# Altium project SuperBALL_Mater_Schematics.PrjPcb
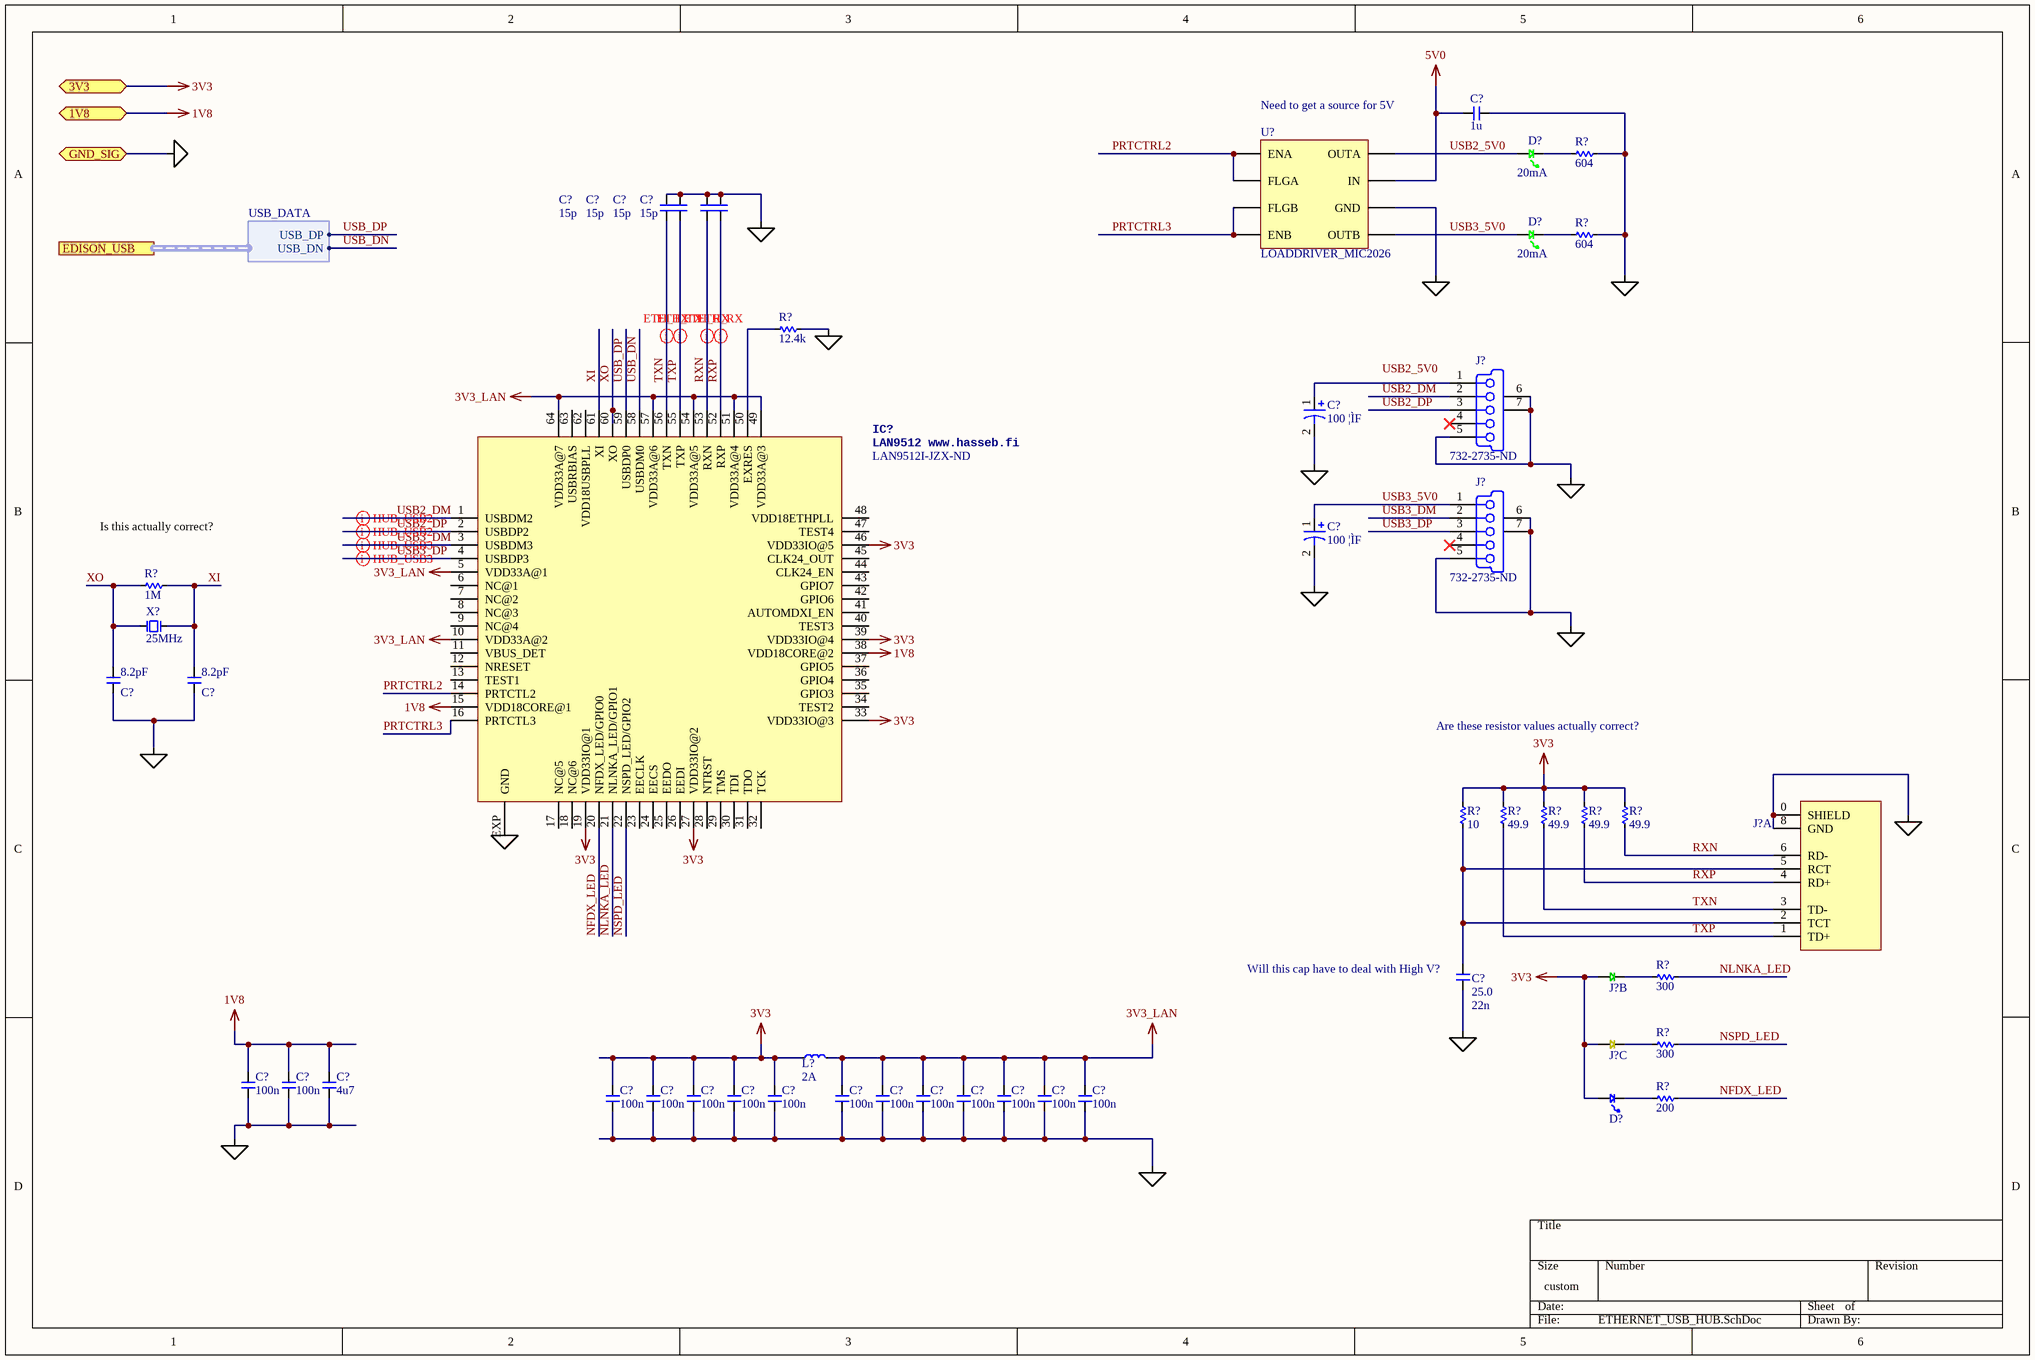
[diagram p0: ETHERNET_USB_HUB.SchDoc]
3 sheets, 59 parts. Net scope: strictly hierarchical (ports join the sheet entries above them; power ports are local).
Board file: Fake.PcbDoc
Sheets:
  ETHERNET_USB_HUB.SchDoc
  PIC.SchDoc
  RF.SchDoc

## Sheet ETHERNET_USB_HUB.SchDoc
size 381 x 254 mm

### Parts
(Parts that share a designator on the sheet are numbered #1, #2 ... from top to bottom, then left to right.)
C?#1  human_value: 1u  [C0603]  (hidden comment: __template_cap)
C?#2  human_value: 15p  [C0603]  (hidden comment: __template_cap)
C?#3  human_value: 15p  [C0603]  (hidden comment: __template_cap)
C?#4  human_value: 15p  [C0603]  (hidden comment: __template_cap)
C?#5  human_value: 15p  [C0603]  (hidden comment: __template_cap)
C?#6  100 ¦ÌF  [WCAP-ASLI 6.3x5.5x2.2]
C?#7  100 ¦ÌF  [WCAP-ASLI 6.3x5.5x2.2]
C?#8  Capacitance: 8.2pF  [c0603]  (hidden comment: __template_cap)
C?#9  Capacitance: 8.2pF  [c0603]  (hidden comment: __template_cap)
C?#10  voltage: 25.0  human_value: 22n  [C0603]  (hidden comment: __template_cap)
C?#11  human_value: 100n  [C0603]  (hidden comment: __template_cap)
C?#12  human_value: 100n  [C0603]  (hidden comment: __template_cap)
C?#13  human_value: 4u7  [C0603]  (hidden comment: __template_cap)
C?#14  human_value: 100n  [C0603]  (hidden comment: __template_cap)
C?#15  human_value: 100n  [C0603]  (hidden comment: __template_cap)
C?#16  human_value: 100n  [C0603]  (hidden comment: __template_cap)
C?#17  human_value: 100n  [C0603]  (hidden comment: __template_cap)
C?#18  human_value: 100n  [C0603]  (hidden comment: __template_cap)
C?#19  human_value: 100n  [C0603]  (hidden comment: __template_cap)
C?#20  human_value: 100n  [C0603]  (hidden comment: __template_cap)
C?#21  human_value: 100n  [C0603]  (hidden comment: __template_cap)
C?#22  human_value: 100n  [C0603]  (hidden comment: __template_cap)
C?#23  human_value: 100n  [C0603]  (hidden comment: __template_cap)
C?#24  human_value: 100n  [C0603]  (hidden comment: __template_cap)
C?#25  human_value: 100n  [C0603]  (hidden comment: __template_cap)
D?#1  Current - Test: 20mA  [0805_Diode]  (hidden comment: LED_LY971)
D?#2  Current - Test: 20mA  [0805_Diode]  (hidden comment: LED_LY971)
D?#3  LED_LBQ39G_BLUE  [LED_0603P_BLUE]  (value not drawn)
IC?  LAN9512 www.hasseb.fi  Supplier Part Number 1: LAN9512I-JZX-ND  [QFN64-9X9]
J?#1  732-2735-ND  [CONN_USBMINIB_VERTICAL_WE]
J?#2  732-2735-ND  [CONN_USBMINIB_VERTICAL_WE]
J?#3  CONN_ETHERNET_MAG_PARJC07-111071A  [ETHERNET_MAG_ARJC07-111071A]  (value not drawn)  (part A of 3)
J?#4  CONN_ETHERNET_MAG_PARJC07-111071A  [ETHERNET_MAG_ARJC07-111071A]  (value not drawn)  (part B of 3)
J?#5  CONN_ETHERNET_MAG_PARJC07-111071A  [ETHERNET_MAG_ARJC07-111071A]  (value not drawn)  (part C of 3)
L?  Current Rating (Max): 2A  [R0603]
R?#1  value 604  [R0603]  (hidden comment: __template_resistor)
R?#2  value 604  [R0603]  (hidden comment: __template_resistor)
R?#3  value 12.4k  [R0603]  (hidden comment: __template_resistor)
R?#4  value 1M  [R0603]  (hidden comment: __template_resistor)
R?#5  value 10  [R0603]  (hidden comment: __template_resistor)
R?#6  value 49.9  [R0603]  (hidden comment: __template_resistor)
R?#7  value 49.9  [R0603]  (hidden comment: __template_resistor)
R?#8  value 49.9  [R0603]  (hidden comment: __template_resistor)
R?#9  value 49.9  [R0603]  (hidden comment: __template_resistor)
R?#10  value 300  [R0603]  (hidden comment: __template_resistor)
R?#11  value 300  [R0603]  (hidden comment: __template_resistor)
R?#12  value 200  [R0603]  (hidden comment: __template_resistor)
U?#1  LOADDRIVER_MIC2026  [8SOIC150]
X?  Frequency: 25MHz  [4_SMD_3.2X2.5MM]  (hidden comment: XTAL_ XC1817CT-ND)

### Ports
1V8, 3V3, EDISON_USB (harness USB_DATA), GND_SIG

### Harnesses
USB_DATA: USB_DP, USB_DN

### Nets
1V8: C?#11.1 C?#12.1 C?#13.1 IC?.15(VDD18CORE@1) IC?.38(VDD18CORE@2) ; port 1V8
3V3: C?#14.1 C?#15.1 C?#16.1 C?#17.1 C?#18.1 D?#3.2 IC?.19(VDD33IO@1) IC?.27(VDD33IO@2) IC?.33(VDD33IO@3) IC?.39(VDD33IO@4) IC?.46(VDD33IO@5) J?#4.11 J?#5.9 L?.1 R?#5.2 R?#6.2 R?#7.2 R?#8.2 R?#9.2 ; port 3V3
3V3_LAN: C?#19.1 C?#20.1 C?#21.1 C?#22.1 C?#23.1 C?#24.1 C?#25.1 IC?.5(VDD33A@1) IC?.10(VDD33A@2) IC?.49(VDD33A@3) IC?.51(VDD33A@4) IC?.54(VDD33A@5) IC?.57(VDD33A@6) IC?.64(VDD33A@7) L?.2
5V0: C?#1.2 U?#1.7(IN)
GDNSIG: C?#1.1 C?#2.1 C?#3.1 C?#4.1 C?#5.1 C?#6.2 C?#7.2 C?#8.2 C?#9.2 C?#10.2 C?#11.2 C?#12.2 C?#13.2 C?#14.2 C?#15.2 C?#16.2 C?#17.2 C?#18.2 C?#19.2 C?#20.2 C?#21.2 C?#22.2 C?#23.2 C?#24.2 C?#25.2 IC?.EXP(GND) J?#1.5(GND) J?#1.6(MH1) J?#1.7(MH2) J?#2.5(GND) J?#2.6(MH1) J?#2.7(MH2) J?#3.0(SHIELD) J?#3.8(GND) R?#1.2 R?#2.2 R?#3.2 U?#1.6(GND) ; port GND_SIG
NFDX_LED: IC?.20(NFDX_LED/GPIO0) R?#12.2
NLNKA_LED: IC?.21(NLNKA_LED/GPIO1) R?#10.2
NSPD_LED: IC?.22(NSPD_LED/GPIO2) R?#11.2
PRTCTRL2: IC?.14(PRTCTL2) U?#1.1(ENA) U?#1.2(FLGA)
PRTCTRL3: IC?.16(PRTCTL3) U?#1.3(FLGB) U?#1.4(ENB)
RXN: C?#4.2 IC?.53(RXN) J?#3.6(RD-) R?#9.1
RXP: C?#5.2 IC?.52(RXP) J?#3.4(RD+) R?#8.1
TXN: C?#2.2 IC?.56(TXN) J?#3.3(TD-) R?#7.1
TXP: C?#3.2 IC?.55(TXP) J?#3.1(TD+) R?#6.1
USB2_5V0: D?#1.2 U?#1.8(OUTA)
USB2_DM: IC?.1(USBDM2) J?#1.2(D-)
USB2_DP: IC?.2(USBDP2) J?#1.3(D+)
USB3_5V0: C?#7.1 D?#2.2 J?#2.1(V_BUS) U?#1.5(OUTB)
USB3_DM: IC?.3(USBDM3) J?#2.2(D-)
USB3_DP: IC?.4(USBDP3) J?#2.3(D+)
USB_DN: IC?.58(USBDM0) ; port EDISON_USB.USB_DN
USB_DP: IC?.59(USBDP0) ; port EDISON_USB.USB_DP
XI: C?#9.1 IC?.61(XI) R?#4.2 X?.2
XO: C?#8.1 IC?.60(XO) R?#4.1 X?.1
NetC?#6_1: C?#6.1 J?#1.1(V_BUS)
NetC?#10_1: C?#10.1 J?#3.2(TCT) J?#3.5(RCT) R?#5.1
NetD?#1_1: D?#1.1 R?#1.1
NetD?#2_1: D?#2.1 R?#2.1
NetD?#3_1: D?#3.1 R?#12.1
NetIC?_50: IC?.50(EXRES) R?#3.1
NetJ?#4_12: J?#4.12 R?#10.1
NetJ?#5_10: J?#5.10 R?#11.1

Not connected (* = marked no-connect by the designer): IC? 6(NC@1) 7(NC@2) 8(NC@3) 9(NC@4) 11(VBUS_DET) 12(NRESET) 13(TEST1) 17(NC@5) 18(NC@6) 23(EECLK) 24(EECS) 25(EEDO) 26(EEDI) 28(NTRST) 29(TMS) 30(TDI) 31(TDO) 32(TCK) 34(TEST2) 35(GPIO3) 36(GPIO4) 37(GPIO5) 40(TEST3) 41(AUTOMDXI_EN) 42(GPIO6) 43(GPIO7) 44(CLK24_EN) 45(CLK24_OUT) 47(TEST4) 48(VDD18ETHPLL) 62(VDD18USBPLL) 63(USBRBIAS); J?#1 4(ID)*; J?#2 4(ID)*

### Layout directives
differential pair: RXN, RXP, TXN, TXP, USB2_DM, USB2_DP, USB3_DM, USB3_DP

### Notes on the sheet
- Need to get a source for 5V
- (near R?#4) Is this actually correct?
- Are these resistor values actually correct?
- (near C?#10) Will this cap have to deal with High V?
- Labels drawn without touching a wire or pin: USB2_5V0

### Library data of the parts
C?#1 = 587-1251-1-ND: voltage: 16.0; type: capacitor; value: 1e-06; tolerance: 10%; Supplier Part Number 1: 587-1251-1-ND; package: 0603; price: 0.125
C?#2-C?#5 = 478-1165-1-ND: voltage: 50.0; type: capacitor; value: 1.5e-11; tolerance: 5%; Supplier Part Number 1: 478-1165-1-ND; package: 0603; price: 0.16
C?#6 C?#7 = WCAP-ASLI 6.3x5.5x2.2 865080243007: WCAP-ASLI Aluminum Electrolytic Capacitors , 100 ¦ÌF; + / - 20%; 10 V , 6,3 x 5,5; Manufacturer: Wurth Elektronik; E-mail: libraries@we-online.com; Characteristics: Aluminum Electrolytic Capacitor;Recommended soldering: Reflow;Operating temperature: ¨C55 ¡ãC to +105 ¡ãC;Low impedance product series;Load life: 2000 h @ +105 ¡ãC; ComponentLink1Description: Manufacturer; ComponentLink1URL: http://www.we-online.com; ComponentLink2Description: Datasheet; ComponentLink2URL: http://katalog.we-online.de/pbs/datasheet/865080243007.pdf; Created by: Karrer Zheng; Created Date: 5/13/2015; Capacitance: 100 ¦ÌF; Application: Energy storage or high frequency filtering in the low voltage circuit; used as power supply filtering in general switching power supply, DC-DC converter, AC-DC converter, conversion adapter, charger, TV, VCR, DC motor circuit filter, digital audio, digital TV, digital camera, digital video camera, satellite receiver, equipment control panel and etc.; partNo: 865080243007
C?#8 C?#9 = __template_cap: Manufacturer: Samsung Electro-Mechanics America, Inc.; Manufacturer Part Number: CL10C8R2DB8NNNC; Tolerance: ±0.5pF; Voltage - Rated: 50V; Temperature Coefficient: C0G, NP0; Supplier 1: Digi-Key; Supplier Part Number 1: 1276-2350-1-ND; RoHS: RoHS Compliant; Category: Capacitors; Stock 1: 133495; Pricing 1: 1=0.1, 10=0.037, 25=0.0264, 50=0.02, 100=0.017, 500=0.0119, 1000=0.00927 (USD); Packaging: Cut Tape (CT); Mounting Type: Surface Mount, MLCC; Operating Temperature: -55°C ~ 125°C; Applications: General Purpose; Ratings: -; Package / Case: 0603 (1608 Metric); Size / Dimension: 0.063" L x 0.031" W (1.60mm x 0.80mm); Height - Seated (Max): -; Thickness (Max): 0.035" (0.90mm); Lead Spacing: -; Features: -; Lead Style: -; ComponentLink1URL: http://www.samsungsem.com/kr/support/product-search/mlcc/CL10C8R2DB8NNNC.jsp; ComponentLink1Description: http://www.samsungsem.com/kr/support/product-search/mlcc/CL10C8R2DB8NNNC.jsp
C?#10 = 399-1094-1-ND: type: capacitor; value: 2.2e-08; tolerance: 10%; Supplier Part Number 1: 399-1094-1-ND; package: 0603; price: 0.093
C?#11 C?#12 C?#14-C?#25 = 399-1097-1-ND: voltage: 16.0; type: capacitor; value: 1e-07; tolerance: 5%; Supplier Part Number 1: 399-1097-1-ND; package: 0603; price: 0.188
C?#13 = 587-1255-1-ND: voltage: 6.3; type: capacitor; value: 4.7e-06; tolerance: 20%; Supplier Part Number 1: 587-1255-1-ND; package: 0603; price: 0.18
D?#1 D?#2 = LED_LY971: LED 0805 GREEN 20MA; Manufacturer: OSRAM Opto Semiconductors Inc; Manufacturer Part Number: LG R971-KN-1; Wavelength - Dominant: 570nm; Wavelength - Peak: 572nm; Millicandela Rating: 26.05mcd; Voltage - Forward (Vf) (Typ): 2.2V; Viewing Angle: 160°; Lens Transparency: Diffused; Lens Color: White; Lens Style/Size: Rectangle with Flat Top, 1.30mm x 1.25mm; Supplier 1: Digi-Key; RoHS: RoHS Compliant; Category: Optoelectronics; Stock 1: 89733; Pricing 1: 1=0.08, 10=0.069, 100=0.0548, 250=0.04796, 500=0.04384 (USD); Packaging: Cut Tape (CT); Color: Green; Package / Case: 0805 (2012 Metric); Supplier Device Package: *; Size / Dimension: 2.00mm L x 1.25mm W; Height (Max): 0.80mm; Mounting Type: Surface Mount; ComponentLink1URL: http://www.osram-os.com/Graphics/XPic9/00078860_0.pdf; ComponentLink1Description: http://www.osram-os.com/Graphics/XPic9/00078860_0.pdf; Supplier Part Number 1: 475-1410-1-ND
D?#3 = LED_LBQ39G_BLUE: Blue 470nm LED Indication - Discrete 2.85V 0603 (1608 Metric); Manufacturer: OSRAM Opto Semiconductors Inc.; Manufacturer Part Number: LB Q39G-L2OO-35-1; Lens Color: White; Lens Transparency: Diffused; Millicandela Rating: 29.5mcd; Lens Style/Size: Rectangle with Flat Top, 1.10mm x 0.80mm; Current - Test: 5mA; Viewing Angle: 155°, 135°; Wavelength - Peak: 472nm; Supplier 1: Digi-Key; RoHS: RoHS Compliant; Category: Optoelectronics; Stock 1: 57960; Pricing 1: 1=0.35, 10=0.25, 25=0.2172, 100=0.167, 250=0.13568, 500=0.10018, 1000=0.08349 (USD); Packaging: Cut Tape (CT); Color: Blue; Voltage - Forward (Vf) (Typ): 2.85V; Mounting Type: Surface Mount; Wavelength - Dominant: 470nm; Features: -; Package / Case: 0603 (1608 Metric); Supplier Device Package: *; Size / Dimension: 1.60mm L x 0.80mm W; Height (Max): 0.40mm; ComponentLink1URL: http://media.digikey.com/pdf/Data%20Sheets/Osram%20PDFs/LB_LT%20Q39G.pdf; ComponentLink1Description: http://media.digikey.com/pdf/Data%20Sheets/Osram%20PDFs/LB_LT%20Q39G.pdf; Supplier Part Number 1: 475-2816-1-ND
IC? = MICROCHIP_LAN9512: Manufacturer: Microchip Technology; Manufacturer Part Number: LAN9512I-JZX; Protocol: Ethernet; Function: Bridge, USB to Ethernet; Interface: USB; Standards: USB 2.0, 10/100 Base-T/TX PHY; Voltage - Supply: 3.3V; Current - Supply: 231mA; Supplier 1: Digi-Key; RoHS: RoHS Compliant; Category: Integrated Circuits (ICs); Stock 1: 914; Pricing 1: 1=6.29, 25=5.24, 100=4.76 (USD); Packaging: Tray; Operating Temperature: -40°C ~ 85°C; Package / Case: 64-VFQFN Exposed Pad; Supplier Device Package: 64-QFN (9x9); ComponentLink1URL: http://www.microchip.com/mymicrochip/filehandler.aspx?ddocname=en562339; ComponentLink1Description: http://www.microchip.com/mymicrochip/filehandler.aspx?ddocname=en562339
J?#1 J?#2 = CONN_USB_MINI_B_WE651005136421: USB - mini B Receptacle Connector 5 Position Through Hole, Vertical; Manufacturer: Wurth Electronics Inc; Number of Contacts: 5; Published: 30-May-2008; Publisher: Altium Limited; Supplier 1: Digi-Key; RoHS: RoHS Compliant; Stock 1: 4612; Pricing 1: 1=2.25, 10=1.95, 50=1.8376, 100=1.65, 500=1.5 (USD); Specifications: -; Supplier 2: Digi-Key; Manufacturer Part Number: 651005136421; Category: Connectors, Interconnects; Stock 2: 4612; Pricing 2: 1=2.25, 10=1.95, 50=1.8376, 100=1.65, 500=1.5 (USD); Packaging: Tray; Connector Type: USB - mini B; Gender: Receptacle; Mounting Type: Through Hole, Vertical; Features: Board Lock, Shielded; Ingress Protection: -; ComponentLink1URL: http://katalog.we-online.de/em/datasheet/651005136421.pdf; ComponentLink1Description: http://katalog.we-online.de/em/datasheet/651005136421.pdf; Supplier Part Number 2: 732-2735-ND
J?#3-J?#5 = CONN_ETHERNET_MAG_PARJC07-111071A: 1 Port RJ45 Magjack Connector Through Hole 10/100 Base-TX, AutoMDIX; Manufacturer: Abracon LLC; Number of Ports: 1; LED Color: Yellow - Green; Number of Cores per Jack: 4; Shielding: Shielded; Tab Direction: User Selectable; Supplier 1: Digi-Key; Manufacturer Part Number: ARJC07-111071A; RoHS: RoHS Compliant; Category: Connectors, Interconnects; Stock 1: 108; Pricing 1: 1=4.23, 10=4.056, 25=3.718, 50=3.549, 100=3.38, 500=2.873, 750=2.61951, 1000=2.4505, 2500=2.2815 (USD); Packaging: Tray; Connector Type: RJ45; Number of Rows: 1; Applications: 10/100 Base-TX, AutoMDIX; Mounting Type: Through Hole; Orientation: Vertical; Termination: Solder; Height Above Board: 0.646" (16.40mm); Features: Board Guide; Contact Material: -; Contact Finish: -; Contact Finish Thickness: -; Shield Material: -; Housing Material: -; Operating Temperature: 0°C ~ 70°C; ComponentLink1URL: http://www.abracon.com/Magnetics/lan/ARJC07-111071A.PDF; ComponentLink1Description: http://www.abracon.com/Magnetics/lan/ARJC07-111071A.PDF; Supplier Part Number 1: 535-12607-ND
L? = __template_inductor: Manufacturer: Murata Electronics North America; Manufacturer Part Number: BLM18PG121SN1D; Filter Type: Power Line; Number of Lines: 1; Impedance @ Frequency: 120 Ohm @ 100MHz; DC Resistance (DCR) (Max): 50 mOhm; Supplier 1: Digi-Key; Supplier Part Number 1: 490-1037-1-ND; RoHS: RoHS Compliant; Category: Filters; Stock 1: 376636; Pricing 1: 1=0.1, 10=0.087, 50=0.0708, 100=0.0519, 250=0.03776, 500=0.0346, 1000=0.02989 (USD); Packaging: Cut Tape (CT); Ratings: -; Operating Temperature: -55°C ~ 125°C; Package / Case: 0603 (1608 Metric); Mounting Type: Surface Mount; Height (Max): 0.037" (0.95mm); Size / Dimension: 0.063" L x 0.031" W (1.60mm x 0.80mm); ComponentLink1URL: http://search.murata.co.jp/Ceramy/image/img/PDF/ENG/L0110S0100BLM18P.pdf; ComponentLink1Description: http://search.murata.co.jp/Ceramy/image/img/PDF/ENG/L0110S0100BLM18P.pdf
R?#1 R?#2 = CRCW0603604RFKEA: RES SMD 604 OHM 1% 1/10W 0603; Manufacturer: Vishay Dale; Unit Price (USD): 0.081; Power (Watts): 0.1W, 1/10W; Supplier Part Number: 541-604HCT-ND; Manufacturer Part Number: CRCW0603604RFKEA; Resistance (Machine readable): 604; type: resistor; Packaging: Cut Tape (CT); Series: CRCW; Tolerance: ±1%; Package: 0603 (1608 Metric)
R?#3 = CRCW060312K4FKEA: RES SMD 12.4K OHM 1% 1/10W 0603; Manufacturer: Vishay Dale; Resistance (Machine readable): 12400; Unit Price (USD): 0.081; Power (Watts): 0.1W, 1/10W; Supplier Part Number: 541-12.4KHCT-ND; Manufacturer Part Number: CRCW060312K4FKEA; type: resistor; Packaging: Cut Tape (CT); Series: CRCW; Tolerance: ±1%; Package: 0603 (1608 Metric)
R?#4 = CRCW06031M00FKEA: RES SMD 1M OHM 1% 1/10W 0603; Manufacturer: Vishay Dale; Resistance (Machine readable): 1000000; Unit Price (USD): 0.081; Power (Watts): 0.1W, 1/10W; Supplier Part Number: 541-1.00MHCT-ND; Manufacturer Part Number: CRCW06031M00FKEA; type: resistor; Packaging: Cut Tape (CT); Series: CRCW; Tolerance: ±1%; Package: 0603 (1608 Metric)
R?#5 = CRCW060310R0FKEA: RES SMD 10 OHM 1% 1/10W 0603; Manufacturer: Vishay Dale; Unit Price (USD): 0.081; Power (Watts): 0.1W, 1/10W; Supplier Part Number: 541-10.0HCT-ND; Manufacturer Part Number: CRCW060310R0FKEA; Resistance (Machine readable): 10; type: resistor; Packaging: Cut Tape (CT); Series: CRCW; Tolerance: ±1%; Package: 0603 (1608 Metric)
R?#6-R?#9 = CRCW060349R9FKEA: RES SMD 49.9 OHM 1% 1/10W 0603; Manufacturer: Vishay Dale; Unit Price (USD): 0.081; Power (Watts): 0.1W, 1/10W; Supplier Part Number: 541-49.9HCT-ND; Manufacturer Part Number: CRCW060349R9FKEA; Resistance (Machine readable): 49.9; type: resistor; Packaging: Cut Tape (CT); Series: CRCW; Tolerance: ±1%; Package: 0603 (1608 Metric)
R?#10 R?#11 = CRCW0603300RFKEA: RES SMD 300 OHM 1% 1/10W 0603; Manufacturer: Vishay Dale; Unit Price (USD): 0.081; Power (Watts): 0.1W, 1/10W; Supplier Part Number: 541-300HCT-ND; Manufacturer Part Number: CRCW0603300RFKEA; Resistance (Machine readable): 300; type: resistor; Packaging: Cut Tape (CT); Series: CRCW; Tolerance: ±1%; Package: 0603 (1608 Metric)
R?#12 = CRCW0603200RFKEA: RES SMD 200 OHM 1% 1/10W 0603; Manufacturer: Vishay Dale; Unit Price (USD): 0.081; Power (Watts): 0.1W, 1/10W; Supplier Part Number: 541-200HCT-ND; Manufacturer Part Number: CRCW0603200RFKEA; Resistance (Machine readable): 200; type: resistor; Packaging: Cut Tape (CT); Series: CRCW; Tolerance: ±1%; Package: 0603 (1608 Metric)
U?#1 = LOADDRIVER_MIC2026: IC SW DISTRIBUTION 2CHAN 8SOIC; Manufacturer: Microchip Technology; Manufacturer Part Number: MIC2026-1YM-TR; Switch Type: General Purpose; Number of Outputs: 2; Ratio - Input:Output: 1:2; Output Configuration: High Side; Output Type: N-Channel; Interface: On/Off; Voltage - Load: 2.7 V ~ 5.5 V; Voltage - Supply (Vcc/Vdd): Not Required; Current - Output (Max): 500mA; Rds On (Typ): 90 mOhm; Input Type: Non-Inverting; Fault Protection: Current Limiting (Fixed), Over Temperature, UVLO; Supplier 1: Digi-Key; RoHS: RoHS Compliant; Category: Integrated Circuits (ICs); Stock 1: 15574; Pricing 1: 1=1, 25=0.84, 100=0.76 (USD); Packaging: Cut Tape (CT); Features: Slew Rate Controlled, Status Flag; Operating Temperature: -40°C ~ 85°C (TA); Package / Case: 8-SOIC (0.154", 3.90mm Width); Supplier Device Package: 8-SOIC; ComponentLink1URL: http://www.microchip.com/mymicrochip/filehandler.aspx?ddocname=en579448; ComponentLink1Description: http://www.microchip.com/mymicrochip/filehandler.aspx?ddocname=en579448; Supplier Part Number 1: 576-1059-1-ND
X? = XTAL_ XC1817CT-ND: 25MHz ±10ppm Crystal 20pF 40 Ohm -20°C ~ 70°C Surface Mount 4-SMD, No Lead (DFN, LCC); pin to pad: 2>3; Manufacturer: ECS Inc.; Manufacturer Part Number: ECS-250-20-33-CKM-TR; ESR (Equivalent Series Resistance): 40 Ohm; Operating Mode: Fundamental; Supplier 1: Digi-Key; RoHS: RoHS Compliant; Category: Crystals and Oscillators; Stock 1: 5860; Packaging: Cut Tape (CT); Type: MHz Crystal; Frequency Stability: ±10ppm; Frequency Tolerance: ±10ppm; Load Capacitance: 20pF; Operating Temperature: -20°C ~ 70°C; Ratings: -; Mounting Type: Surface Mount; Package / Case: 4-SMD, No Lead (DFN, LCC); Size / Dimension: 0.126" L x 0.098" W (3.20mm x 2.50mm); Height: 0.031" (0.80mm); ComponentLink1URL: http://www.ecsxtal.com/store/pdf/ecx-32.pdf; ComponentLink1Description: http://www.ecsxtal.com/store/pdf/ecx-32.pdf; Supplier Part Number 1: XC1817CT-ND; Pricing 1: 1=1.04, 10=0.92, 50=0.8588, 100=0.76, 500=0.7182 (USD)

## Sheet PIC.SchDoc
size 381 x 254 mm
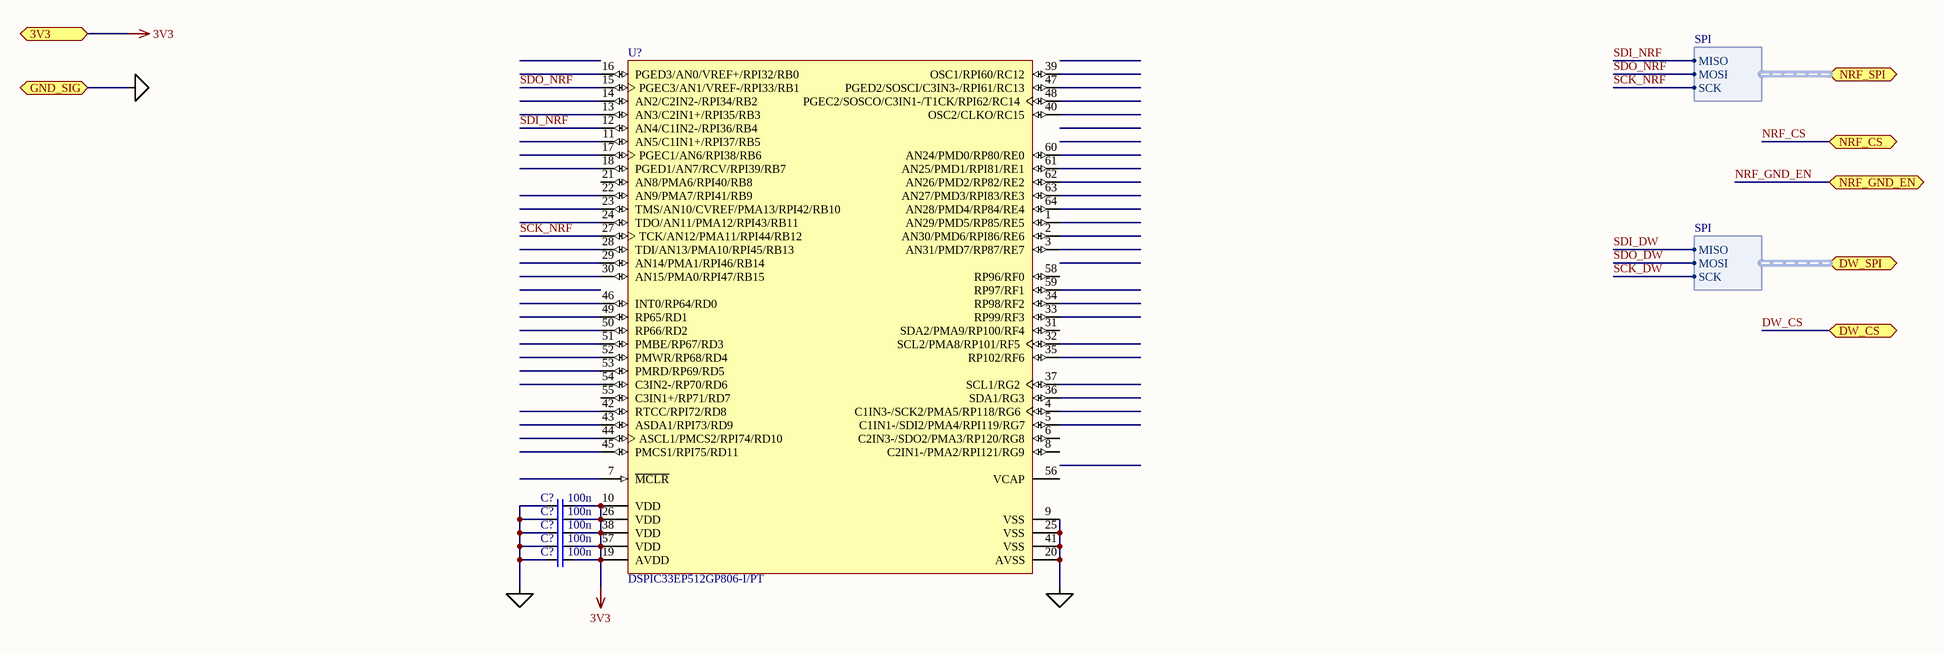
[diagram p1: PIC.SchDoc]

### Parts
(Parts that share a designator on the sheet are numbered #1, #2 ... from top to bottom, then left to right.)
C?#26  human_value: 100n  [C0603]  (hidden comment: __template_cap)
C?#27  human_value: 100n  [C0603]  (hidden comment: __template_cap)
C?#28  human_value: 100n  [C0603]  (hidden comment: __template_cap)
C?#29  human_value: 100n  [C0603]  (hidden comment: __template_cap)
C?#30  human_value: 100n  [C0603]  (hidden comment: __template_cap)
U?#2  DSPIC33EP512GP806-I/PT  [MCHP-TQFP-PT64_N]

### Ports
3V3, DW_CS, DW_SPI (harness SPI), GND_SIG, NRF_CS, NRF_GND_EN, NRF_SPI (harness SPI)

### Harnesses
SPI: MISO, MOSI, SCK

### Nets
3V3: C?#26.2 C?#27.2 C?#28.2 C?#29.2 C?#30.2 U?#2.10(VDD) U?#2.19(AVDD) U?#2.26(VDD) U?#2.38(VDD) U?#2.57(VDD) ; port 3V3
GDNSIG: C?#26.1 C?#27.1 C?#28.1 C?#29.1 C?#30.1 U?#2.9(VSS) U?#2.20(AVSS) U?#2.25(VSS) U?#2.41(VSS) ; port GND_SIG
DW_CS: port DW_CS
NRF_CS: port NRF_CS
NRF_GND_EN: port NRF_GND_EN
SCK_DW: port DW_SPI.SCK
SCK_NRF: U?#2.27(TCK/AN12/PMA11/RPI44/RB12) ; port NRF_SPI.SCK
SDI_DW: port DW_SPI.MISO
SDI_NRF: U?#2.12(AN4/C1IN2-/RPI36/RB4) ; port NRF_SPI.MISO
SDO_DW: port DW_SPI.MOSI
SDO_NRF: U?#2.15(PGEC3/AN1/VREF-/RPI33/RB1) ; port NRF_SPI.MOSI

Not connected (* = marked no-connect by the designer): U?#2 1(AN29/PMD5/RP85/RE5) 2(AN30/PMD6/RPI86/RE6) 3(AN31/PMD7/RP87/RE7) 4(C1IN3-/SCK2/PMA5/RP118/RG6) 5(C1IN1-/SDI2/PMA4/RPI119/RG7) 6(C2IN3-/SDO2/PMA3/RP120/RG8) 7(~{MCLR}) 8(C2IN1-/PMA2/RPI121/RG9) 11(AN5/C1IN1+/RPI37/RB5) 13(AN3/C2IN1+/RPI35/RB3) 14(AN2/C2IN2-/RPI34/RB2) 16(PGED3/AN0/VREF+/RPI32/RB0) 17(PGEC1/AN6/RPI38/RB6) 18(PGED1/AN7/RCV/RPI39/RB7) 21(AN8/PMA6/RPI40/RB8) 22(AN9/PMA7/RPI41/RB9) 23(TMS/AN10/CVREF/PMA13/RPI42/RB10) 24(TDO/AN11/PMA12/RPI43/RB11) 28(TDI/AN13/PMA10/RPI45/RB13) 29(AN14/PMA1/RPI46/RB14) 30(AN15/PMA0/RPI47/RB15) 31(SDA2/PMA9/RP100/RF4) 32(SCL2/PMA8/RP101/RF5) 33(RP99/RF3) 34(RP98/RF2) 35(RP102/RF6) 36(SDA1/RG3) 37(SCL1/RG2) 39(OSC1/RPI60/RC12) 40(OSC2/CLKO/RC15) 42(RTCC/RPI72/RD8) 43(ASDA1/RPI73/RD9) 44(ASCL1/PMCS2/RPI74/RD10) 45(PMCS1/RPI75/RD11) 46(INT0/RP64/RD0) 47(PGED2/SOSCI/C3IN3-/RPI61/RC13) 48(PGEC2/SOSCO/C3IN1-/T1CK/RPI62/RC14) 49(RP65/RD1) 50(RP66/RD2) 51(PMBE/RP67/RD3) 52(PMWR/RP68/RD4) 53(PMRD/RP69/RD5) 54(C3IN2-/RP70/RD6) 55(C3IN1+/RP71/RD7) 56(VCAP) 58(RP96/RF0) 59(RP97/RF1) 60(AN24/PMD0/RP80/RE0) 61(AN25/PMD1/RPI81/RE1) 62(AN26/PMD2/RP82/RE2) 63(AN27/PMD3/RPI83/RE3) 64(AN28/PMD4/RP84/RE4)

### Library data of the parts
C?#26-C?#30 = 478-3726-1-ND: voltage: 16.0; type: capacitor; value: 1e-07; tolerance: 5%; Supplier Part Number 1: 478-3726-1-ND; package: 0603; price: 0.374
U?#2 = DSPIC33EP512GP806-I/PT: 16-Bit Microcontroller and Digital Signal Controller with High-Speed PWM, USB and Advanced Analog, 70 MIPS, 53 I/O, PMP, -40 to 85 degC, 64-pin TQFP (PT64), Tray; Manufacturer: Microchip; DatasheetVersion: Rev. G; PackageVersion: C04-085B; PackageReference: TQFP-PT64; PackageDescription: 64-Lead Plastic Thin Quad FlatPack, 10 x 10 mm Body, 0.5 mm Pitch; Supplier 1: Digi-Key; Supplier Part Number 1: DSPIC33EP512GP806-I/PT-ND; Supplier 2: Newark; Supplier Part Number 2: 72T9311; Supplier 3: Mouser; Supplier Part Number 3: 579-33EP512GP806IPT; Mounting Technology: Surface Mount; PartNumber: DSPIC33EP512GP806-I/PT; ComponentLink1Description: Manufacturer URL; ComponentLink1URL: http://www.microchip.com; ComponentLink2Description: Datasheet; ComponentLink2URL: http://ww1.microchip.com/downloads/en/DeviceDoc/70616g.pdf; ComponentLink3Description: Package Specification; ComponentLink3URL: http://www.microchip.com/stellent/groups/techpub_sg/documents/packagingspec/en012702.pdf; ComponentLink4Description: Product URL; ComponentLink4URL: http://www.microchip.com/dsPIC33EP512GP806

## Sheet RF.SchDoc
size A
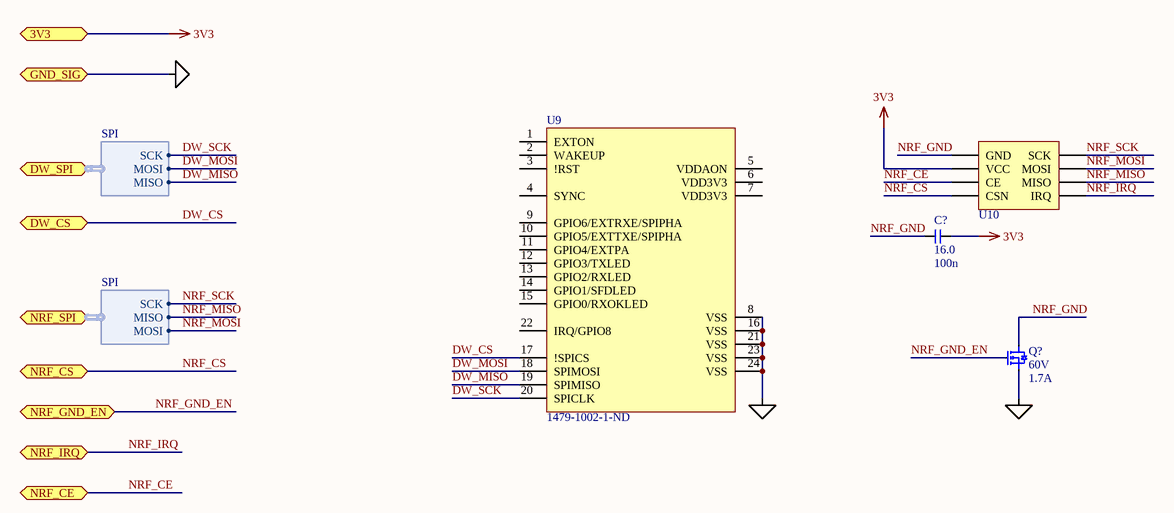
[diagram p2: RF.SchDoc]

### Parts
(Parts that share a designator on the sheet are numbered #1, #2 ... from top to bottom, then left to right.)
C?#31  voltage: 16.0  human_value: 100n  [C0603]  (hidden comment: __template_cap)
Q?  Drain to Source Voltage (Vdss): 60V  Current - Continuous Drain (Id) @ 25° C: 1.7A  [3SOT23]  (hidden comment: MOSFET N-CH 60V 1.7A SSOT3)
U9  Supplier Part Number 1: 1479-1002-1-ND  [decawave_DWM1000]  (hidden comment: DECAWAVE_DWM1000)
U10  SEEEDSTUDIO_nRF24L01+  [SEEEDSTUDIO_nRF24L01]  (value not drawn)

### Ports
3V3, DW_CS, DW_SPI (harness SPI), GND_SIG, NRF_CE, NRF_CS, NRF_GND_EN, NRF_IRQ, NRF_SPI (harness SPI)

### Harnesses
SPI: MISO, MOSI, SCK

### Nets
3V3: C?#31.1 U10.2(VCC) ; port 3V3
GDNSIG: Q?.2 U9.8(VSS) U9.16(VSS) U9.21(VSS) U9.23(VSS) U9.24(VSS) ; port GND_SIG
DW_CS: U9.17(!SPICS) ; port DW_CS
DW_MISO: U9.19(SPIMISO) ; port DW_SPI.MISO
DW_MOSI: U9.18(SPIMOSI) ; port DW_SPI.MOSI
DW_SCK: U9.20(SPICLK) ; port DW_SPI.SCK
NRF_CE: U10.3(CE) ; port NRF_CE
NRF_CS: U10.4(CSN) ; port NRF_CS
NRF_GND: C?#31.2 Q?.3 U10.1(GND)
NRF_GND_EN: Q?.1 ; port NRF_GND_EN
NRF_IRQ: U10.8(IRQ) ; port NRF_IRQ
NRF_MISO: U10.7(MISO) ; port NRF_SPI.MISO
NRF_MOSI: U10.6(MOSI) ; port NRF_SPI.MOSI
NRF_SCK: U10.5(SCK) ; port NRF_SPI.SCK

Not connected (* = marked no-connect by the designer): U9 1(EXTON) 2(WAKEUP) 3(!RST) 4(SYNC) 5(VDDAON) 6(VDD3V3) 7(VDD3V3) 9(GPIO6/EXTRXE/SPIPHA) 10(GPIO5/EXTTXE/SPIPHA) 11(GPIO4/EXTPA) 12(GPIO3/TXLED) 13(GPIO2/RXLED) 14(GPIO1/SFDLED) 15(GPIO0/RXOKLED) 22(IRQ/GPIO8)

### Library data of the parts
C?#31 = 478-3726-1-ND: type: capacitor; value: 1e-07; description: CAP CER 0.1UF 16V 5% X7R 0603; tolerance: 5%; Supplier Part Number 1: 478-3726-1-ND; package: 0603; price: 0.374
Q? = NFET_FDN5630: Manufacturer: Fairchild Semiconductor; FET Type: MOSFET N-Channel, Metal Oxide; FET Feature: Logic Level Gate; Rds On (Max) @ Id, Vgs: 100 mOhm @ 1.7A, 10V; Vgs(th) (Max) @ Id: 3V @ 250µA; Gate Charge (Qg) @ Vgs: 10nC @ 10V; Input Capacitance (Ciss) @ Vds: 400pF @ 15V; Power - Max: 460mW; Supplier 1: Digi-Key; Manufacturer Part Number: FDN5630; RoHS: RoHS Compliant; Category: Discrete Semiconductor Products; Stock 1: 136076; Pricing 1: 1=0.66, 10=0.532, 100=0.3986, 250=0.34428, 500=0.29596, 1000=0.22952 (USD); Mounting Type: Surface Mount; Package / Case: TO-236-3, SC-59, SOT-23-3; Supplier Device Package: 3-SSOT; Packaging: Cut Tape (CT); ComponentLink1URL: http://www.fairchildsemi.com/ds/FD/FDN5630.pdf; ComponentLink1Description: http://www.fairchildsemi.com/ds/FD/FDN5630.pdf; Supplier Part Number 1: FDN5630CT-ND
U9 = DECAWAVE_DWM1000: RF TXRX MODULE 802.15.4 CHIP ANT; Manufacturer: Decawave Limited; Protocol: IR-UWB; Modulation: BPM, BPSK; Frequency: 3.5GHz ~ 6.5GHz; Data Rate: 6.8Mbps; Serial Interfaces: SPI; Antenna Type: Integrated, Chip; Voltage - Supply: 2.8 V ~ 3.6 V; Current - Receiving: 64mA; Current - Transmitting: 31mA; Supplier 1: Digi-Key; Manufacturer Part Number: DWM1000; RoHS: RoHS Compliant; Category: RF/IF and RFID; Stock 1: 6649; Pricing 1: 1=25.59, 10=23.625, 25=21.6564, 100=20.0156, 250=19.03124 (USD); Packaging: Cut Tape (CT); RF Family/Standard: 802.15.4; Power - Output: -; Sensitivity: -; Memory Size: -; Mounting Type: Surface Mount; Operating Temperature: -40°C ~ 85°C; Package / Case: Module; ComponentLink1URL: http://www.decawave.com/sites/default/files/resources/dwm1000-datasheet-v1.3.pdf; ComponentLink1Description: http://www.decawave.com/sites/default/files/resources/dwm1000-datasheet-v1.3.pdf
U10 = SEEEDSTUDIO_nRF24L01+: RF24L01 ULP 2Mbps RF transceiver 2.4GHz ISM